# EAGLE design NanosecondPulseGenerator (EAGLE 9.6.2)
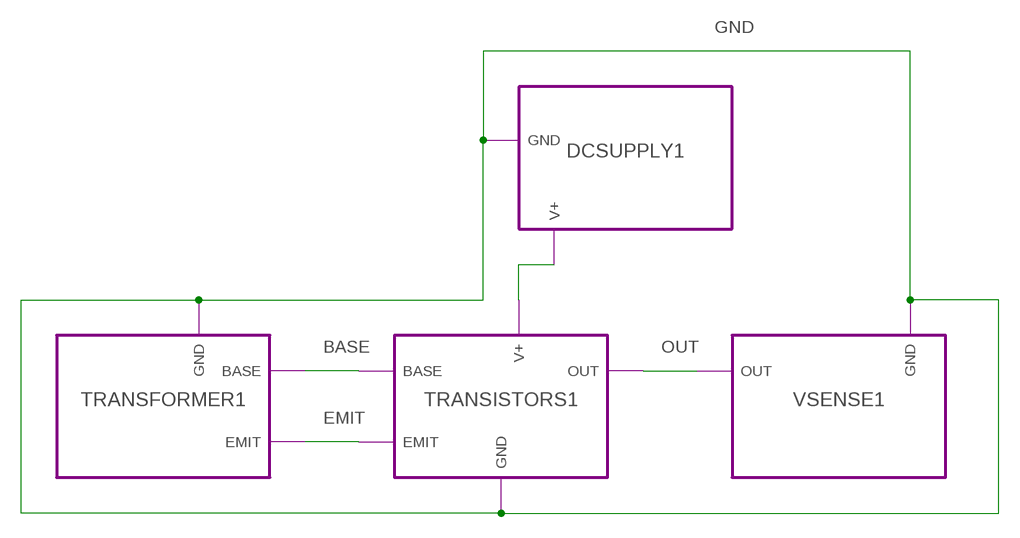
[diagram p0: schematic, sheet 1]

## Module instances
DCSUPPLY1 = DCSUPPLY
TRANSFORMER1 = TRANSFORMER
TRANSISTORS1 = TRANSISTORS
VSENSE1 = VSENSE

## Nets
BASE: port TRANSISTORS1.BASE TRANSFORMER1.BASE
EMIT: port TRANSISTORS1.EMIT TRANSFORMER1.EMIT
GND: port TRANSISTORS1.GND VSENSE1.GND DCSUPPLY1.GND TRANSFORMER1.GND
N$3: port TRANSISTORS1.V+ DCSUPPLY1.V+
OUT: port TRANSISTORS1.OUT VSENSE1.OUT

## Library data of the parts

## Module DCSUPPLY
Ports: V+(pwr) GND(pwr)
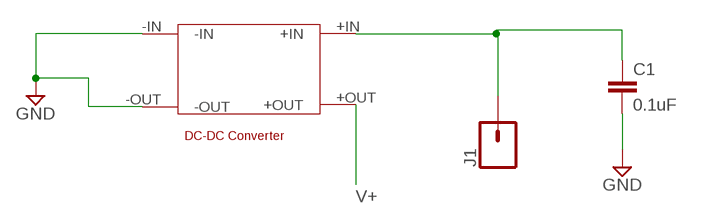
[diagram p1: schematic, module DCSUPPLY, sheet 1]

### Parts
C1  0.1uF  0.1UF-0603-25V-5%  [0603]
J1  CONN_01SNAP-FEMALE  [SNAP-FEMALE]
U$1  DC-DCCONVERTER  [DC-CONVERTER]

### Nets
GND: C1.2 U$1.-IN U$1.-OUT
N$1: C1.1 J1.1 U$1.+IN
V+: U$1.+OUT

### Library data of the parts
C1 = SparkFun-Capacitors:0.1UF: 0.1µF ceramic capacitors A capacitor is a passive two-terminal electrical component used to store electrical energy temporarily in an electric field.; PROD_ID: CAP-08604
J1 = SparkFun-Connectors:CONN_01: Single connection point. Often used as Generic Header-pin footprint for 0.1 inch spaced/style header connections On any of the 0.1 inch spaced packages, you can populate with these: Break Away Headers - Straight <https://www.sparkfun.com/products/116> (PRT-00116) Break Away Male Headers - Right Angle <https://www.sparkfun.com/products/553> (PRT-00553) Female Headers <https://www.sparkfun.com/products/115> (PRT-00115) Break Away Headers - Machine Pin <https://www.sparkfun.com/products/117> (PRT-00117) Break Away Female Headers - Swiss Machine Pin <https://www.sparkfun.com/products/743> (PRT-00743) This device is also useful as a general connection point to wire up your design to another part of your project. Our various solder wires solder well into these plated through hole pads. Hook-Up Wire - Assortment (Stranded, 22 AWG) <https://www.sparkfun.com/products/11375> (PRT-11375) Hook-Up Wire - Assortment (Solid Core, 22 AWG) <https://www.sparkfun.com/products/11367> (PRT-11367) View the entire wire category on our website here <https://www.sparkfun.com/categories/141> Special notes: SMTSO-256-ET is a "flush mount" nut for a 4-40 screw. We mostly use this on specialty testbeds; it is a nice way to connect hardware to your PCB at an adjustable hieght. Also note, the SNAP packages are for using a snappable style connector. We sell a baggie of snaps and they are also used on two LilyPad designs: Snap Assortment - 30 pack (male and female) <https://www.sparkfun.com/products/11347> (DEV-11347) LilyPad Arduino SimpleSnap <https://www.sparkfun.com/products/10941> (DEV-10941) LilyPad SimpleSnap Protoboard <https://www.sparkfun.com/products/10940> (DEV-10940)
U$1 = AblationLibrary:DC-DCCONVERTER

## Module TRANSFORMER
Ports: BASE(pwr) EMIT(pwr) GND(pwr)
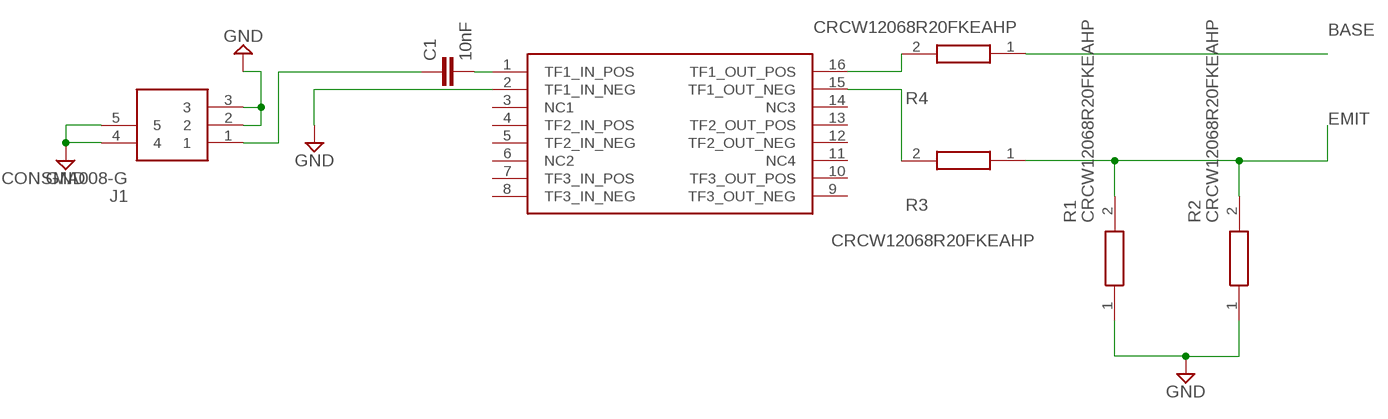
[diagram p2: schematic, module TRANSFORMER, sheet 1]

### Parts
C1  10nF  10NF-0603-50V-10%  [0603]
J1  CONSMA008-G  [CONSMA008G]
R1  CRCW12068R20FKEAHP  [RESC3116X65N]
R2  CRCW12068R20FKEAHP  [RESC3116X65N]
R3  CRCW12068R20FKEAHP  [RESC3116X65N]
R4  CRCW12068R20FKEAHP  [RESC3116X65N]
U$1  TX1:1_QUAD  [SOIC127P1067X508-16N]

### Nets
BASE: R4.1
EMIT: R1.2 R2.2 R3.1
GND: J1.2 J1.3 J1.4 J1.5 R1.1 R2.1 U$1.2(TF1_IN_NEG)
N$1: R4.2 U$1.16(TF1_OUT_POS)
N$2: C1.1 J1.1
N$3: C1.2 U$1.1(TF1_IN_POS)
N$4: R3.2 U$1.15(TF1_OUT_NEG)
Unconnected: U$1.3(NC1) U$1.4(TF2_IN_POS) U$1.5(TF2_IN_NEG) U$1.6(NC2) U$1.7(TF3_IN_POS) U$1.8(TF3_IN_NEG) U$1.9(TF3_OUT_NEG) U$1.10(TF3_OUT_POS) U$1.11(NC4) U$1.12(TF2_OUT_NEG) U$1.13(TF2_OUT_POS) U$1.14(NC3)

### Library data of the parts
C1 = SparkFun-Capacitors:10NF: 0.01uF/10nF/10,000pF ceramic capacitors A capacitor is a passive two-terminal electrical component used to store electrical energy temporarily in an electric field. CAP-09321; PROD_ID: CAP-00867
J1 = SamacSys_Parts:CONSMA008-G: RF Connectors / Coaxial Connectors SMA Female PCB Mnt, Extended, Gold Source: Datasheet <https://www.mouser.at/datasheet/2/238/consma008-g-1544682.pdf>; DESCRIPTION: RF Connectors / Coaxial Connectors SMA Female PCB Mnt, Extended, Gold; HEIGHT: 13.48mm; MANUFACTURER_NAME: Linx Technologies; MANUFACTURER_PART_NUMBER: CONSMA008-G; MOUSER_PART_NUMBER: 712-CONSMA008-G; MOUSER_PRICE-STOCK: https://www.mouser.co.uk/ProductDetail/Linx-Technologies/CONSMA008-G?qs=vLWxofP3U2zf85vM2YDg9g%3D%3D
R1-R4 = SamacSys_Parts:CRCW12068R20FKEAHP: VISHAY - CRCW12068R20FKEAHP - RES, AEC-Q200, THICK FILM, 8R2, 1206 Source: Datasheet <http://componentsearchengine.com/Datasheets/2/CRCW12068R20FKEAHP.pdf>; DESCRIPTION: VISHAY - CRCW12068R20FKEAHP - RES, AEC-Q200, THICK FILM, 8R2, 1206; HEIGHT: 0.65mm; MANUFACTURER_NAME: Vishay; MANUFACTURER_PART_NUMBER: CRCW12068R20FKEAHP; MOUSER_PART_NUMBER: 71-CRCW12068R20FKEAH; MOUSER_PRICE-STOCK: https://www.mouser.co.uk/ProductDetail/Vishay-Dale/CRCW12068R20FKEAHP?qs=40TFAHZMFvejawn2vMU8IQ%3D%3D
U$1 = transformer:TX1:1_QUAD

## Module TRANSISTORS
Ports: BASE(pwr) EMIT(pwr) GND(pwr) OUT(pwr) V+(pwr)
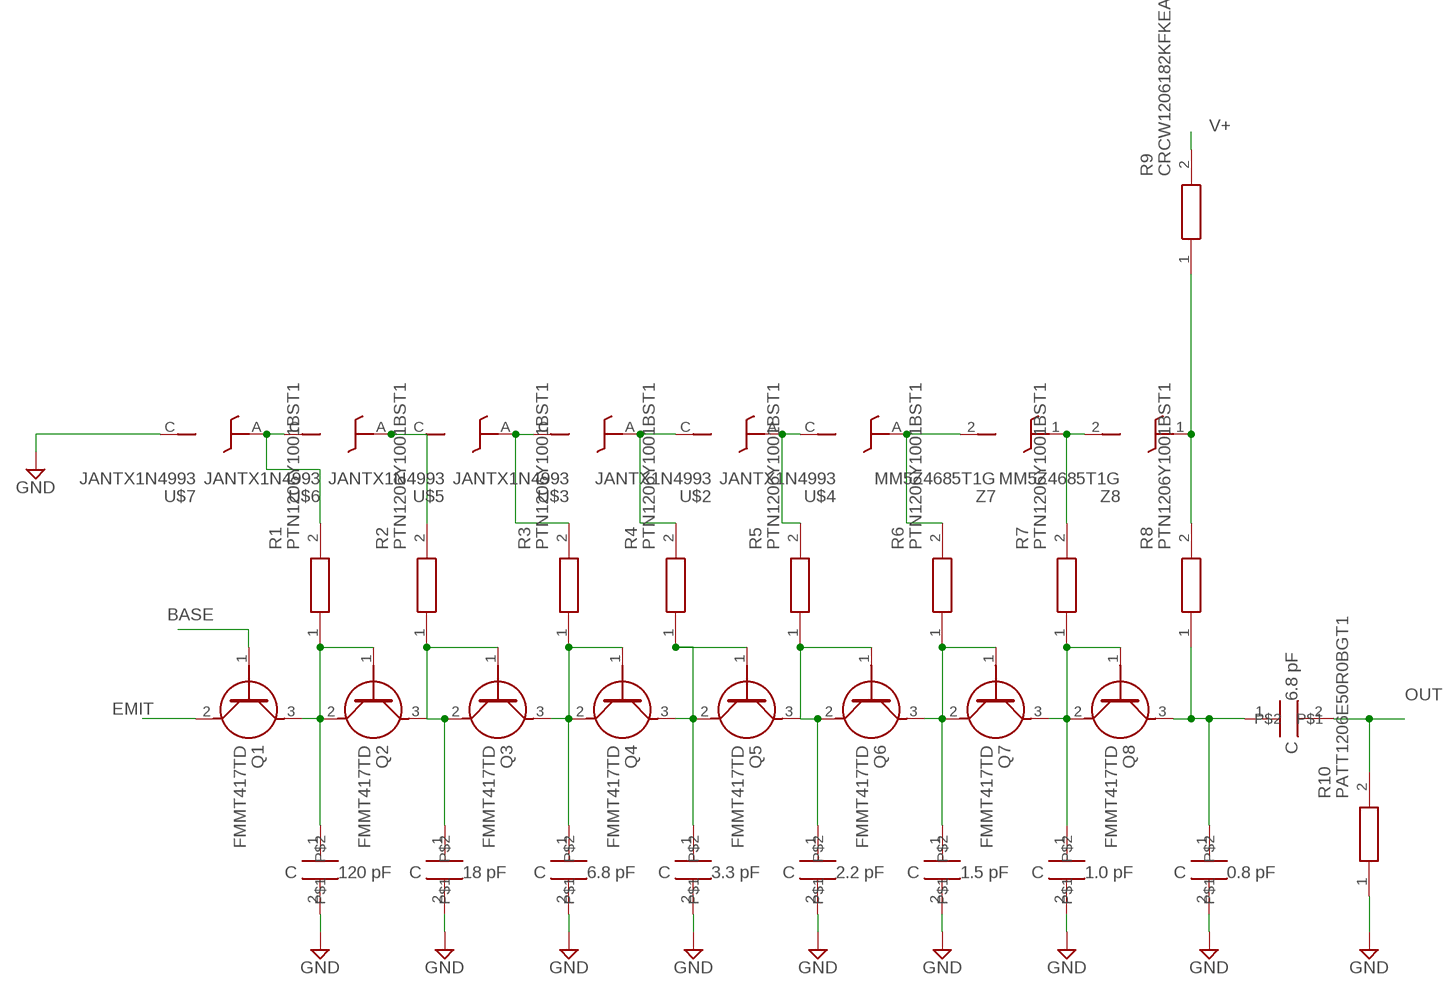
[diagram p3: schematic, module TRANSISTORS, sheet 1]

### Parts
Q1  FMMT417TD  [SOT96P240X110-3N]
Q2  FMMT417TD  [SOT96P240X110-3N]
Q3  FMMT417TD  [SOT96P240X110-3N]
Q4  FMMT417TD  [SOT96P240X110-3N]
Q5  FMMT417TD  [SOT96P240X110-3N]
Q6  FMMT417TD  [SOT96P240X110-3N]
Q7  FMMT417TD  [SOT96P240X110-3N]
Q8  FMMT417TD  [SOT96P240X110-3N]
R1  PTN1206Y1001BST1  [RESC3216X84N]
R2  PTN1206Y1001BST1  [RESC3216X84N]
R3  PTN1206Y1001BST1  [RESC3216X84N]
R4  PTN1206Y1001BST1  [RESC3216X84N]
R5  PTN1206Y1001BST1  [RESC3216X84N]
R6  PTN1206Y1001BST1  [RESC3216X84N]
R7  PTN1206Y1001BST1  [RESC3216X84N]
R8  PTN1206Y1001BST1  [RESC3216X84N]
R9  CRCW1206182KFKEA  [RESC3216X60N]
R10  PATT1206E50R0BGT1  [RESC3216X46N]
U$1  CAP_120PF  [CAPCP5963X368N]
U$2  JANTX1N4993  [DIOAD1274W101L533D349B]
U$3  JANTX1N4993  [DIOAD1274W101L533D349B]
U$4  JANTX1N4993  [DIOAD1274W101L533D349B]
U$5  JANTX1N4993  [DIOAD1274W101L533D349B]
U$6  JANTX1N4993  [DIOAD1274W101L533D349B]
U$7  JANTX1N4993  [DIOAD1274W101L533D349B]
U$8  CAP_18PF  [CAPCP5963X368N]
U$9  CAP_6.8PF  [CAPCP5963X368N]
U$10  CAP_3.3PF  [CAPCP5963X368N]
U$11  CAP_2.2PF  [CAPCP2927X200N]
U$12  CAP_1.5PF  [CAPCP2927X178N]
U$13  CAP_1.0PF  [CAPCP2927X178N]
U$14  CAP_0.8PF  [CAPCP2927X178N]
U$15  CAP_6.8PF  [CAPCP5963X368N]
Z7  MM5Z4685T1G  [SODFL1608X70N]
Z8  MM5Z4685T1G  [SODFL1608X70N]

### Nets
BASE: Q1.1(B)
EMIT: Q1.2(E)
GND: R10.1 U$1.2 U$7.C U$8.2 U$9.2 U$10.2 U$11.2 U$12.2 U$13.2 U$14.2
N$1: Q1.3(C) Q2.1(B) Q2.2(E) R1.1 U$1.1
N$2: R8.2 R9.1 Z8.1(K)
N$4: Q4.3(C) Q5.1(B) Q5.2(E) R4.1 U$10.1
N$8: R3.2 U$3.C U$5.A
N$9: Q2.3(C) Q3.1(B) Q3.2(E) R2.1 U$8.1
N$10: Q3.3(C) Q4.1(B) Q4.2(E) R3.1 U$9.1
N$12: Q5.3(C) Q6.1(B) Q6.2(E) R5.1 U$11.1
N$13: Q6.3(C) Q7.1(B) Q7.2(E) R6.1 U$12.1
N$14: Q7.3(C) Q8.1(B) Q8.2(E) R7.1 U$13.1
N$15: Q8.3(C) R8.1 U$14.1 U$15.1
N$16: R7.2 Z7.1(K) Z8.2(A)
N$17: R6.2 U$4.A Z7.2(A)
N$18: R4.2 U$2.C U$3.A
N$19: R2.2 U$5.C U$6.A
N$20: R1.2 U$6.C U$7.A
N$22: R5.2 U$2.A U$4.C
OUT: R10.2 U$15.2
V+: R9.2

### Library data of the parts
Q1-Q8 = SamacSys_Parts:FMMT417TD: Trans GP BJT NPN 100V 0.5A Automotive 3-Pin SOT-23 T/R Source: Datasheet <https://www.arrow.com/en/products/fmmt417td/diodes-incorporated>; ARROW_PART_NUMBER: FMMT417TD; ARROW_PRICE-STOCK: https://www.arrow.com/en/products/fmmt417td/diodes-incorporated; DESCRIPTION: Trans GP BJT NPN 100V 0.5A Automotive 3-Pin SOT-23 T/R; HEIGHT: 1.1mm; MANUFACTURER_NAME: Diodes Inc.; MANUFACTURER_PART_NUMBER: FMMT417TD; MOUSER_PART_NUMBER: 522-FMMT417TD; MOUSER_PRICE-STOCK: https://www.mouser.co.uk/ProductDetail/Diodes-Incorporated/FMMT417TD/?qs=GedFDFLaBXGMAHlxwKf7CQ%3D%3D
R1-R8 = SamacSys_Parts:PTN1206Y1001BST1: Thin Film Resistors - SMD 0.4W 1Kohm 0.1% 10ppm Source: Datasheet <https://www.mouser.co.uk/datasheet/2/427/ptn-1763593.pdf>; DESCRIPTION: Thin Film Resistors - SMD 0.4W 1Kohm 0.1% 10ppm; HEIGHT: 0.838mm; MANUFACTURER_NAME: Vishay; MANUFACTURER_PART_NUMBER: PTN1206Y1001BST1; MOUSER_PART_NUMBER: 71-PTN1206Y1001BST1; MOUSER_PRICE-STOCK: https://www.mouser.co.uk/ProductDetail/Vishay-Thin-Film/PTN1206Y1001BST1/?qs=vtpzqDgAobk49TBIdJGYGg%3D%3D
R9 = SamacSys_Parts:CRCW1206182KFKEA: RESISTOR, 1206 182K Ohms +/-1% 0.25W Source: Datasheet; DESCRIPTION: RESISTOR, 1206 182K Ohms +/-1% 0.25W; HEIGHT: 0.6mm; MANUFACTURER_NAME: Vishay; MANUFACTURER_PART_NUMBER: CRCW1206182KFKEA
R10 = AblationLibrary:PATT1206E50R0BGT1: RES SMD 50 OHM 0.1% 0.4W 1206 Source: Datasheet <http://www.vishay.com/docs/60124/patt.pdf>; DESCRIPTION: RES SMD 50 OHM 0.1% 0.4W 1206; HEIGHT: 0.457mm; MANUFACTURER_NAME: Vishay; MANUFACTURER_PART_NUMBER: PATT1206E50R0BGT1; MOUSER_PART_NUMBER: 71-PATT1206E50R0BGT1; MOUSER_PRICE-STOCK: https://www.mouser.co.uk/ProductDetail/Vishay-Thin-Film/PATT1206E50R0BGT1/?qs=YCa%2FAAYMW02FK3DA43scSg%3D%3D
U$1 = AblationLibrary_part2:CAP_120PF
U$2-U$7 = AblationLibrary:JANTX1N4993: 300 V Zener
U$8 = AblationLibrary_part2:CAP_18PF
U$9 U$15 = AblationLibrary_part2:CAP_6.8PF
U$10 = AblationLibrary_part2:CAP_3.3PF
U$11 = AblationLibrary_part2:CAP_2.2PF
U$12 = AblationLibrary_part2:CAP_1.5PF
U$13 = AblationLibrary_part2:CAP_1.0PF
U$14 = AblationLibrary_part2:CAP_0.8PF
Z7 Z8 = SamacSys_Parts:MM5Z4685T1G: Zener Diodes LOW IZ REG .5W Source: Datasheet; DESCRIPTION: Zener Diodes LOW IZ REG .5W; HEIGHT: 0.7mm; MANUFACTURER_NAME: ON Semiconductor; MANUFACTURER_PART_NUMBER: MM5Z4685T1G; MOUSER_PART_NUMBER: 863-MM5Z4685T1G; MOUSER_PRICE-STOCK: https://www.mouser.co.uk/ProductDetail/ON-Semiconductor/MM5Z4685T1G?qs=xZ%2FP%252Ba9zWqa%252Bzxdln6mGUw%3D%3D

## Module VSENSE
Ports: OUT(pwr) GND(pwr)
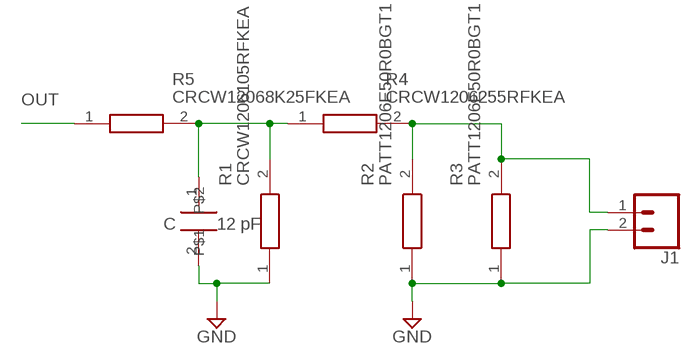
[diagram p4: schematic, module VSENSE, sheet 1]

### Parts
J1  CONN_021X02_NO_SILK  [1X02_NO_SILK]
R1  CRCW1206105RFKEA  [RESC3216X60N]
R2  PATT1206E50R0BGT1  [RESC3216X46N]
R3  PATT1206E50R0BGT1  [RESC3216X46N]
R4  CRCW1206255RFKEA  [RESC3216X60N]
R5  CRCW12068K25FKEA  [RESC3216X60N]
U$1  CAP_12PF  [CAPCP5963X368N]

### Nets
GND: J1.2 R1.1 R2.1 R3.1 U$1.2
N$1: J1.1 R2.2 R3.2 R4.2
N$2: R1.2 R4.1 R5.2 U$1.1
OUT: R5.1

### Library data of the parts
J1 = SparkFun-Connectors:CONN_02: Multi connection point. Often used as Generic Header-pin footprint for 0.1 inch spaced/style header connections On any of the 0.1 inch spaced packages, you can populate with these: Break Away Headers - Straight <https://www.sparkfun.com/products/116> (PRT-00116) Break Away Male Headers - Right Angle <https://www.sparkfun.com/products/553> (PRT-00553) Female Headers <https://www.sparkfun.com/products/115> (PRT-00115) Break Away Headers - Machine Pin <https://www.sparkfun.com/products/117> (PRT-00117) Break Away Female Headers - Swiss Machine Pin <https://www.sparkfun.com/products/743> (PRT-00743) For SCREWTERMINALS and SPRING TERMINALS visit here: Screw Terimnals on SparkFun.com <https://www.sparkfun.com/search/results?term=Screw+Terminals> (5mm/3.5mm/2.54mm spacing) This device is also useful as a general connection point to wire up your design to another part of your project. Our various solder wires solder well into these plated through hole pads. Hook-Up Wire - Assortment (Stranded, 22 AWG) <https://www.sparkfun.com/products/11375> (PRT-11375) Hook-Up Wire - Assortment (Solid Core, 22 AWG) <https://www.sparkfun.com/products/11367> (PRT-11367) View the entire wire category on our website here <https://www.sparkfun.com/categories/141> Special notes: Molex polarized connector foot print use with: PRT-08233 with associated crimp pins and housings. 2.54_SCREWTERM for use with PRT-10571. 3.5mm Screw Terminal footprints for PRT-08084 5mm Screw Terminal footprints for use with PRT-08432
R1 = SamacSys_Parts:CRCW1206105RFKEA: RESISTOR, 1206 105 Ohms +/-1% 0.25W Source: Datasheet <https://componentsearchengine.com/Datasheets/1/CRCW1206105RFKEA.pdf>; DESCRIPTION: RESISTOR, 1206 105 Ohms +/-1% 0.25W; HEIGHT: 0.6mm; MANUFACTURER_NAME: Vishay; MANUFACTURER_PART_NUMBER: CRCW1206105RFKEA; MOUSER_PART_NUMBER: 71-CRCW1206105-E3; MOUSER_PRICE-STOCK: https://www.mouser.com/Search/Refine.aspx?Keyword=71-CRCW1206105-E3
R2 R3 = SamacSys_Parts:PATT1206E50R0BGT1: RES SMD 50 OHM 0.1% 0.4W 1206 Source: Datasheet <http://www.vishay.com/docs/60124/patt.pdf>; DESCRIPTION: RES SMD 50 OHM 0.1% 0.4W 1206; HEIGHT: 0.457mm; MANUFACTURER_NAME: Vishay; MANUFACTURER_PART_NUMBER: PATT1206E50R0BGT1; MOUSER_PART_NUMBER: 71-PATT1206E50R0BGT1; MOUSER_PRICE-STOCK: https://www.mouser.co.uk/ProductDetail/Vishay-Thin-Film/PATT1206E50R0BGT1/?qs=YCa%2FAAYMW02FK3DA43scSg%3D%3D
R4 = SamacSys_Parts:CRCW1206255RFKEA: RESISTOR, 1206 255 Ohms +/-1% 0.25W Source: Datasheet <https://componentsearchengine.com/Datasheets/1/CRCW1206255RFKEA.pdf>; DESCRIPTION: RESISTOR, 1206 255 Ohms +/-1% 0.25W; HEIGHT: 0.6mm; MANUFACTURER_NAME: Vishay; MANUFACTURER_PART_NUMBER: CRCW1206255RFKEA; MOUSER_PART_NUMBER: 71-CRCW1206-255-E3; MOUSER_PRICE-STOCK: https://www.mouser.com/Search/Refine.aspx?Keyword=71-CRCW1206-255-E3
R5 = SamacSys_Parts:CRCW12068K25FKEA: Vishay CRCW Series Thick Film Surface Mount Resistor 1206 Case 8.25k +/-1% 0.25W +/-100ppm/C Source: Datasheet <http://www.vishay.com/docs/20035/dcrcwe3.pdf>; DESCRIPTION: Vishay CRCW Series Thick Film Surface Mount Resistor 1206 Case 8.25k +/-1% 0.25W +/-100ppm/C; HEIGHT: 0.6mm; MANUFACTURER_NAME: Vishay; MANUFACTURER_PART_NUMBER: CRCW12068K25FKEA; MOUSER_PART_NUMBER: 71-CRCW1206-8.25K-E3; MOUSER_PRICE-STOCK: https://www.mouser.co.uk/ProductDetail/Vishay-Dale/CRCW12068K25FKEA?qs=RBObajmC9bHr%2FYjALHq7iQ%3D%3D
U$1 = AblationLibrary_part2:CAP_12PF

## Board
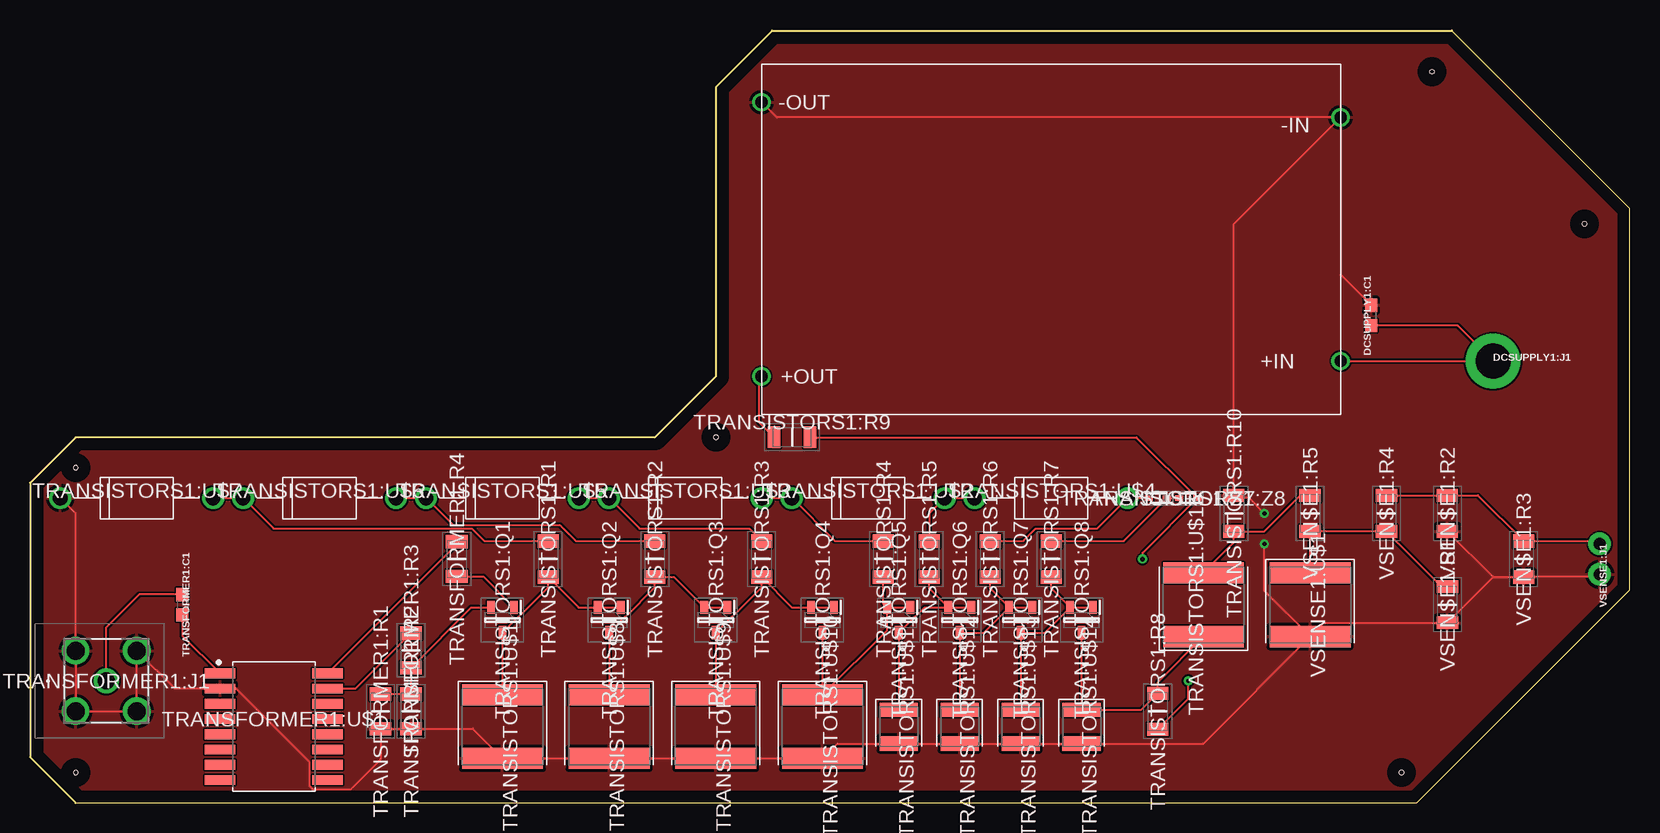
[diagram p5: board, top side]
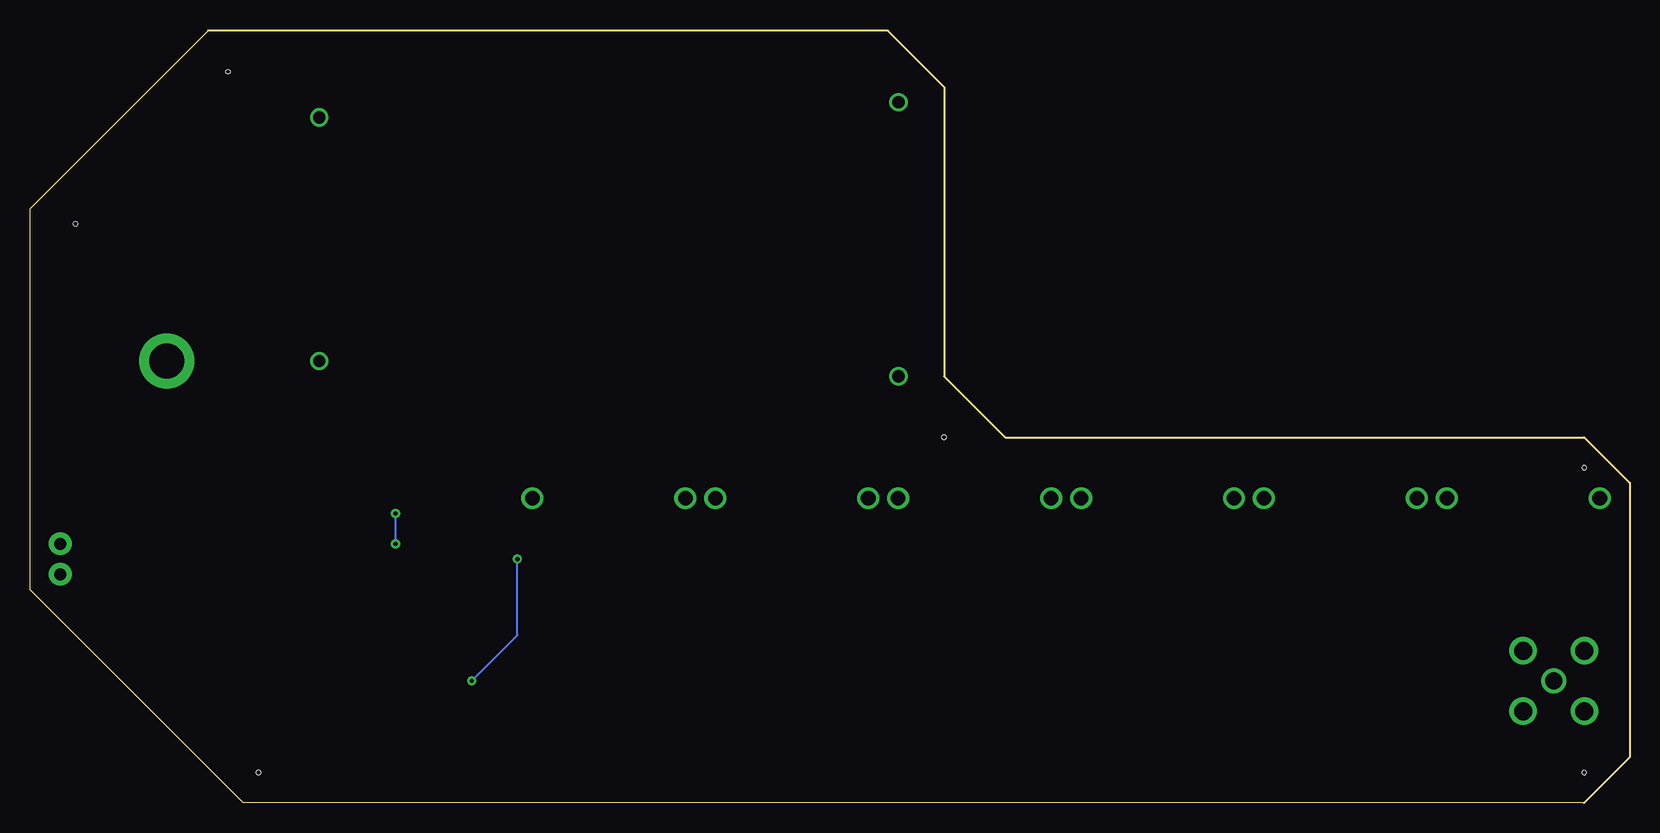
[diagram p6: board, bottom side, seen from below]

Size 133.33 x 64.44 mm. Coordinates in mm from the lower left corner, seen from the top.
Outline: 118.49,64.39 133.33,49.55 133.33,17.76 115.57,0 3.81,0 0,3.81
Outline: 118.49,64.39 118.44,64.44
Outline: 0,26.06 0,3.81
Outline: 0,3.81 0,26.67 3.81,30.48 52.07,30.48 57.15,35.56 57.15,59.69 61.85,64.39 118.49,64.39
Copper layers (1*16): Top 0.035mm / dielectric 1.5mm / Bottom 0.035mm
Design rules "default": minimum track width 6mil, minimum drill 0.35mm, track to track 6mil, track to pad 6mil, pad to pad 6mil, via to via 6mil, smd to smd 6mil, copper to edge 40mil, drill to drill 6mil, minimum pad ring 10mil, minimum via ring 8mil, stop-mask expansion 4mil, vias tented up to drill 0mil, thermal gap 10mil
Holes 0.35 mm at 3.81,2.54 3.81,27.94 57.15,30.48 116.84,60.96 129.54,48.26 114.3,2.54

### Footprints (pad centres in the part's own frame; a part is rotated, then mirrored left to right if it is on the bottom)
0603 = smd 1.1 x 1: 1 -0.85,0; 2 0.85,0
SNAP-FEMALE = drill 2.921 pad 4.572: 1 0,0
DC-CONVERTER = drill 1.016: +IN -24.13,10.16; +OUT 24.13,11.43; -IN -24.13,-10.16; -OUT 24.13,-11.43
CONSMA008G = drill 1.4 pad 1.95: 1 0,0 | drill 1.5 pad 2.3: 2 -2.55,2.525; 3 -2.55,-2.525; 4 2.55,-2.525; 5 2.55,2.525
RESC3116X65N = smd 1.1 x 1.8: 1 -1.45,0; 2 1.45,0
SOIC127P1067X508-16N = smd 2.522 x 0.812: 1 -4.48,4.445; 2 -4.48,3.175; 3 -4.48,1.905; 4 -4.48,0.635; 5 -4.48,-0.635; 6 -4.48,-1.905; 7 -4.48,-3.175; 8 -4.48,-4.445; 9 4.48,-4.445; 10 4.48,-3.175; 11 4.48,-1.905; 12 4.48,-0.635; 13 4.48,0.635; 14 4.48,1.905; 15 4.48,3.175; 16 4.48,4.445
SOT96P240X110-3N = smd 1.1 x 0.65: 1 -1.05,0.96; 2 -1.05,-0.96; 3 1.05,0
RESC3216X84N = smd 1.1 x 1.75: 1 -1.5,0; 2 1.5,0
RESC3216X60N = smd 1.05 x 1.8: 1 -1.5,0; 2 1.5,0
RESC3216X46N = smd 1.1 x 1.75: 1 -1.5,0; 2 1.5,0
CAPCP5963X368N = smd 1.758 x 6.738: 1 -2.65,0; 2 2.65,0
DIOAD1274W101L533D349B = drill 1.216 pad 1.824: A 6.372,0; C -6.372,0
CAPCP2927X200N = smd 1.187 x 3.178: 1 -1.411,0; 2 1.411,0
CAPCP2927X178N = smd 1.187 x 3.178: 1 -1.411,0; 2 1.411,0
SODFL1608X70N = smd 0.64 x 0.42: 1 -0.75,0; 2 0.75,0
1X02_NO_SILK = drill 1.016 pad 1.88: 1 0,0; 2 2.54,0

### Placement (x,y rotation side)
DCSUPPLY1:C1  0.1uF  [0603]  111.76,40.64 90 top
DCSUPPLY1:J1  [SNAP-FEMALE]  121.92,36.83 0 top
DCSUPPLY1:U$1  DC-DCCONVERTER  [DC-CONVERTER]  85.09,46.99 180 top
TRANSFORMER1:C1  10nF  [0603]  12.7,16.51 270 top
TRANSFORMER1:J1  CONSMA008-G  [CONSMA008G]  6.35,10.16 0 top
TRANSFORMER1:R1  CRCW12068R20FKEAHP  [RESC3116X65N]  29.21,7.62 90 top
TRANSFORMER1:R2  CRCW12068R20FKEAHP  [RESC3116X65N]  31.75,7.62 90 top
TRANSFORMER1:R3  CRCW12068R20FKEAHP  [RESC3116X65N]  31.75,12.7 90 top
TRANSFORMER1:R4  CRCW12068R20FKEAHP  [RESC3116X65N]  35.56,20.32 90 top
TRANSFORMER1:U$1  TX1:1_QUAD  [SOIC127P1067X508-16N]  20.32,6.35 0 top
TRANSISTORS1:Q1  FMMT417TD  [SOT96P240X110-3N]  39.37,15.24 270 top
TRANSISTORS1:Q2  FMMT417TD  [SOT96P240X110-3N]  48.26,15.24 270 top
TRANSISTORS1:Q3  FMMT417TD  [SOT96P240X110-3N]  57.15,15.24 270 top
TRANSISTORS1:Q4  FMMT417TD  [SOT96P240X110-3N]  66.04,15.24 270 top
TRANSISTORS1:Q5  FMMT417TD  [SOT96P240X110-3N]  72.39,15.24 270 top
TRANSISTORS1:Q6  FMMT417TD  [SOT96P240X110-3N]  77.47,15.24 270 top
TRANSISTORS1:Q7  FMMT417TD  [SOT96P240X110-3N]  82.55,15.24 270 top
TRANSISTORS1:Q8  FMMT417TD  [SOT96P240X110-3N]  87.63,15.24 270 top
TRANSISTORS1:R1  PTN1206Y1001BST1  [RESC3216X84N]  43.18,20.32 90 top
TRANSISTORS1:R2  PTN1206Y1001BST1  [RESC3216X84N]  52.07,20.32 90 top
TRANSISTORS1:R3  PTN1206Y1001BST1  [RESC3216X84N]  60.96,20.32 90 top
TRANSISTORS1:R4  PTN1206Y1001BST1  [RESC3216X84N]  71.12,20.32 90 top
TRANSISTORS1:R5  PTN1206Y1001BST1  [RESC3216X84N]  74.93,20.32 90 top
TRANSISTORS1:R6  PTN1206Y1001BST1  [RESC3216X84N]  80.01,20.32 90 top
TRANSISTORS1:R7  PTN1206Y1001BST1  [RESC3216X84N]  85.09,20.32 90 top
TRANSISTORS1:R8  PTN1206Y1001BST1  [RESC3216X84N]  93.98,7.62 270 top
TRANSISTORS1:R9  CRCW1206182KFKEA  [RESC3216X60N]  63.5,30.48 180 top
TRANSISTORS1:R10  PATT1206E50R0BGT1  [RESC3216X46N]  100.33,24.13 270 top
TRANSISTORS1:U$1  CAP_120PF  [CAPCP5963X368N]  39.37,6.35 270 top
TRANSISTORS1:U$2  JANTX1N4993  [DIOAD1274W101L533D349B]  69.85,25.4 0 top
TRANSISTORS1:U$3  JANTX1N4993  [DIOAD1274W101L533D349B]  54.61,25.4 0 top
TRANSISTORS1:U$4  JANTX1N4993  [DIOAD1274W101L533D349B]  85.09,25.4 0 top
TRANSISTORS1:U$5  JANTX1N4993  [DIOAD1274W101L533D349B]  39.37,25.4 0 top
TRANSISTORS1:U$6  JANTX1N4993  [DIOAD1274W101L533D349B]  24.13,25.4 0 top
TRANSISTORS1:U$7  JANTX1N4993  [DIOAD1274W101L533D349B]  8.89,25.4 0 top
TRANSISTORS1:U$8  CAP_18PF  [CAPCP5963X368N]  48.26,6.35 270 top
TRANSISTORS1:U$9  CAP_6.8PF  [CAPCP5963X368N]  57.15,6.35 270 top
TRANSISTORS1:U$10  CAP_3.3PF  [CAPCP5963X368N]  66.04,6.35 270 top
TRANSISTORS1:U$11  CAP_2.2PF  [CAPCP2927X200N]  72.39,6.35 270 top
TRANSISTORS1:U$12  CAP_1.5PF  [CAPCP2927X178N]  77.47,6.35 270 top
TRANSISTORS1:U$13  CAP_1.0PF  [CAPCP2927X178N]  82.55,6.35 270 top
TRANSISTORS1:U$14  CAP_0.8PF  [CAPCP2927X178N]  87.63,6.35 270 top
TRANSISTORS1:U$15  CAP_6.8PF  [CAPCP5963X368N]  97.79,16.51 90 top
TRANSISTORS1:Z7  MM5Z4685T1G  [SODFL1608X70N]  93.98,25.4 180 top
TRANSISTORS1:Z8  MM5Z4685T1G  [SODFL1608X70N]  96.52,25.4 180 top
VSENSE1:J1  [1X02_NO_SILK]  130.81,21.59 270 top
VSENSE1:R1  CRCW1206105RFKEA  [RESC3216X60N]  118.11,16.51 90 top
VSENSE1:R2  PATT1206E50R0BGT1  [RESC3216X46N]  118.11,24.13 90 top
VSENSE1:R3  PATT1206E50R0BGT1  [RESC3216X46N]  124.46,20.32 90 top
VSENSE1:R4  CRCW1206255RFKEA  [RESC3216X60N]  113.03,24.13 90 top
VSENSE1:R5  CRCW12068K25FKEA  [RESC3216X60N]  106.68,24.13 270 top
VSENSE1:U$1  CAP_12PF  [CAPCP5963X368N]  106.68,16.51 270 top

### Tracks (layer width: path | path; a pad name or v marks a point on that pad's centre or on a via)
BASE
  Top 0.152: TRANSFORMER1:R4.1 37.75,18.87 TRANSISTORS1:Q1.1
DCSUPPLY1:N$1
  Top 0.152: DCSUPPLY1:C1.1 118.96,39.79 DCSUPPLY1:J1.1 DCSUPPLY1:U$1.+IN
EMIT
  Top 0.152: TRANSFORMER1:R1.2 TRANSFORMER1:R2.2 TRANSFORMER1:R3.1 36.79,16.29 TRANSISTORS1:Q1.2
GND  (via drill 0.35)
  Top 0.152: VSENSE1:U$1.2 97.76,4.94 TRANSISTORS1:U$14.2 TRANSISTORS1:U$13.2 TRANSISTORS1:U$12.2 TRANSISTORS1:U$11.2 67.28,4.94 TRANSISTORS1:U$10.2 TRANSISTORS1:U$9.2 TRANSISTORS1:U$8.2 TRANSISTORS1:U$1.2 36.9,6.17 TRANSFORMER1:R2.1 TRANSFORMER1:R1.1 29.21,3.63 26.67,1.09 23.62,1.09 23.31,1.4 23.31,3.36 17.14,9.53 TRANSFORMER1:U$1.2 12.06,9.53 TRANSFORMER1:J1.5 TRANSFORMER1:J1.4 TRANSFORMER1:J1.3 TRANSFORMER1:J1.2 3.8,24.12 TRANSISTORS1:U$7.C | VSENSE1:U$1.2 107.83,15.01 VSENSE1:R1.1 121.92,18.82 | VSENSE1:J1.2 130.58,18.82 VSENSE1:R3.1 121.92,18.82 | VSENSE1:R2.1 121.92,18.82 | DCSUPPLY1:C1.2 109.22,44.03 DCSUPPLY1:U$1.-IN | DCSUPPLY1:U$1.-IN 100.33,48.26 TRANSISTORS1:R10.1 100.56,25.4 101.6,25.4 v102.87,24.13 | DCSUPPLY1:U$1.-IN 62.23,57.15 DCSUPPLY1:U$1.-OUT | VSENSE1:U$1.2 102.87,17.67 v102.87,21.59
  Bottom 0.152: v102.87,21.59 v102.87,24.13
  pour Top: -2.54,67.31 -2.54,-1.27 135.89,-1.27 135.89,67.31
N$3
  Top 0.152: DCSUPPLY1:U$1.+OUT 60.73,35.33 60.73,31.75 TRANSISTORS1:R9.2
OUT
  Top 0.152: VSENSE1:R5.1 105.87,25.63 102.87,22.63 TRANSISTORS1:R10.2 100.33,21.7 TRANSISTORS1:U$15.2
TRANSFORMER1:N$1
  Top 0.152: TRANSFORMER1:U$1.16 35.56,21.55 TRANSFORMER1:R4.2
TRANSFORMER1:N$2
  Top 0.152: TRANSFORMER1:C1.1 9.09,17.36 6.35,14.62 TRANSFORMER1:J1.1
TRANSFORMER1:N$3
  Top 0.152: TRANSFORMER1:C1.2 12.7,13.94 TRANSFORMER1:U$1.1
TRANSFORMER1:N$4
  Top 0.152: TRANSFORMER1:U$1.15 27.12,9.53 TRANSFORMER1:R3.2
TRANSISTORS1:N$1
  Top 0.152: TRANSISTORS1:U$1.1 TRANSISTORS1:Q1.3 40.69,15.51 40.75,15.51 43.18,17.94 TRANSISTORS1:R1.1 45.71,16.29 TRANSISTORS1:Q2.2 TRANSISTORS1:Q2.1
TRANSISTORS1:N$2  (via drill 0.35)
  Top 0.152: TRANSISTORS1:R9.1 92.19,30.48 TRANSISTORS1:Z8.1 92.71,20.84 v92.71,20.32 | TRANSISTORS1:R8.2 96.52,8.66 v96.52,10.16
  Bottom 0.152: v96.52,10.16 92.71,13.97 v92.71,20.32
TRANSISTORS1:N$4
  Top 0.152: TRANSISTORS1:Q4.3 TRANSISTORS1:U$10.1 71.43,14.39 TRANSISTORS1:Q5.2 | TRANSISTORS1:Q5.2 TRANSISTORS1:Q5.1 | TRANSISTORS1:Q5.2 71.12,16.6 TRANSISTORS1:R4.1
TRANSISTORS1:N$8
  Top 0.152: TRANSISTORS1:U$5.A TRANSISTORS1:U$3.C 48.26,25.4 50.8,22.86 59.92,22.86 TRANSISTORS1:R3.2
TRANSISTORS1:N$9
  Top 0.152: TRANSISTORS1:U$8.1 TRANSISTORS1:Q2.3 49.58,15.51 49.64,15.51 52.07,17.94 TRANSISTORS1:R2.1 53.66,18.82 TRANSISTORS1:Q3.2 TRANSISTORS1:Q3.1
TRANSISTORS1:N$10
  Top 0.152: TRANSISTORS1:U$9.1 TRANSISTORS1:Q3.3 58.47,15.51 58.53,15.51 60.96,17.94 TRANSISTORS1:R3.1 63.49,16.29 TRANSISTORS1:Q4.2 TRANSISTORS1:Q4.1
TRANSISTORS1:N$12
  Top 0.152: TRANSISTORS1:U$11.1 TRANSISTORS1:Q5.3 73.71,15.51 73.77,15.51 74.55,16.29 TRANSISTORS1:Q6.2 | TRANSISTORS1:Q6.2 74.93,17.87 TRANSISTORS1:R5.1 | TRANSISTORS1:Q6.2 TRANSISTORS1:Q6.1
TRANSISTORS1:N$13
  Top 0.152: TRANSISTORS1:U$12.1 TRANSISTORS1:Q6.3 79.49,14.19 TRANSISTORS1:Q7.2 | TRANSISTORS1:Q7.2 TRANSISTORS1:Q7.1 | TRANSISTORS1:Q7.2 80.01,17.87 TRANSISTORS1:R6.1
TRANSISTORS1:N$14
  Top 0.152: TRANSISTORS1:Q8.2 84.57,14.19 TRANSISTORS1:Q7.3 TRANSISTORS1:U$13.1 | TRANSISTORS1:Q8.2 TRANSISTORS1:Q8.1 | TRANSISTORS1:Q8.2 85.09,17.87 TRANSISTORS1:R7.1
TRANSISTORS1:N$15
  Top 0.152: TRANSISTORS1:Q8.3 TRANSISTORS1:U$14.1 92.62,7.76 TRANSISTORS1:R8.1 93.98,10.05 TRANSISTORS1:U$15.1
TRANSISTORS1:N$16
  Top 0.152: TRANSISTORS1:Z8.2 TRANSISTORS1:Z7.1 91.15,21.82 TRANSISTORS1:R7.2
TRANSISTORS1:N$17
  Top 0.152: TRANSISTORS1:Z7.2 TRANSISTORS1:U$4.A 88.92,22.86 83.82,22.86 82.78,21.82 TRANSISTORS1:R6.2
TRANSISTORS1:N$18
  Top 0.152: TRANSISTORS1:U$3.A TRANSISTORS1:U$2.C 63.5,25.4 67.08,21.82 TRANSISTORS1:R4.2
TRANSISTORS1:N$19
  Top 0.152: TRANSISTORS1:U$6.A TRANSISTORS1:U$5.C 33.02,25.4 35.26,23.16 44.15,23.16 45.49,21.82 TRANSISTORS1:R2.2
TRANSISTORS1:N$20
  Top 0.152: TRANSISTORS1:U$7.A TRANSISTORS1:U$6.C 20.3,22.86 36.83,22.86 37.87,21.82 TRANSISTORS1:R1.2
TRANSISTORS1:N$22
  Top 0.152: TRANSISTORS1:U$4.C TRANSISTORS1:U$2.A 74.93,24.11 TRANSISTORS1:R5.2
VSENSE1:N$1
  Top 0.152: VSENSE1:J1.1 130.58,21.82 VSENSE1:R3.2 120.65,25.63 VSENSE1:R2.2 VSENSE1:R4.2
VSENSE1:N$2
  Top 0.152: VSENSE1:R1.2 117.65,18.01 VSENSE1:R4.1 VSENSE1:R5.2 VSENSE1:U$1.1